# EAGLE design StandaloneAnemometer_RevB (EAGLE 7.6.0)

## Sheet 1 of 3
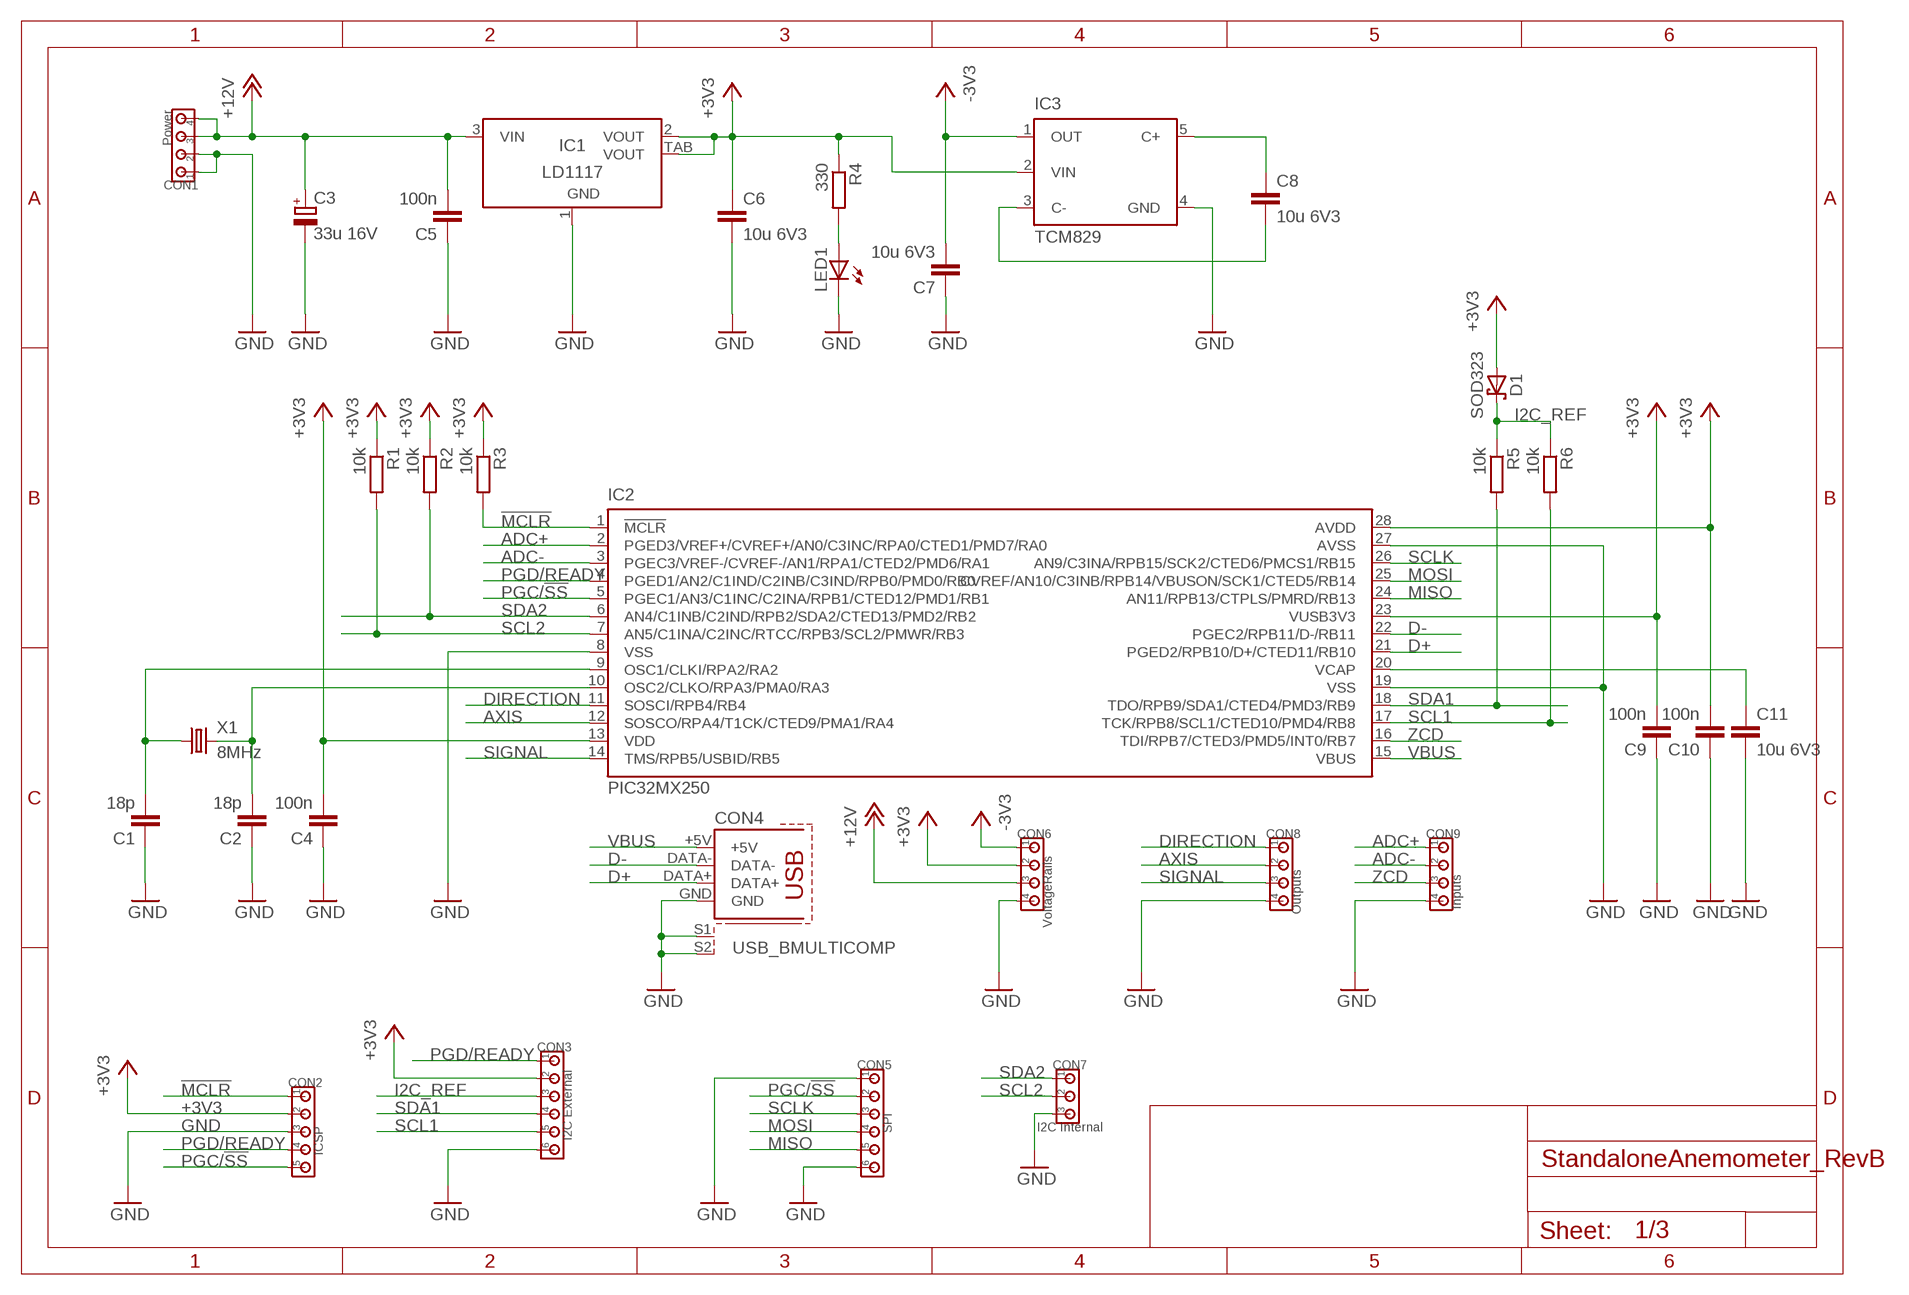
[diagram p0: schematic, sheet 1]

### Parts
C1  18p  CC0805  [C0805]
C2  18p  CC0805  [C0805]
C3  33u 16V  C_POLARIZEDSMC_B  [SMC_B]
C4  100n  CC0805  [C0805]
C5  100n  CC0805  [C0805]
C6  10u 6V3  CC0805  [C0805]
C7  10u 6V3  CC0805  [C0805]
C8  10u 6V3  CC0805  [C0805]
C9  100n  CC0805  [C0805]
C10  100n  CC0805  [C0805]
C11  10u 6V3  CC0805  [C0805]
CON1  Power  CON_4X100MIL  [100MIL_4X]
CON2  ICSP  CON_5X100MIL  [100MIL_5X]
CON3  I2C External  CON_6X100MIL  [100MIL_6X]
CON4  USB_BMULTICOMP  [USB_B]
CON5  SPI  CON_6X100MIL  [100MIL_6X]
CON6  VoltageRails  CON_4X100MIL  [100MIL_4X]
CON7  I2C Internal  CON_3X100MIL  [100MIL_3X]
CON8  Outputs  CON_4X100MIL  [100MIL_4X]
CON9  Inputs  CON_4X100MIL  [100MIL_4X]
D1  SOD323  SCHOTTKYSOD323  [SOD323]
IC1  LD1117  [SOT223]
IC2  PIC32MX250  PIC32MX2XX  [SO28W]
IC3  TCM829  [SOT-23-5]
LED1  LED0805  [LED0805]
R1  10k  RESISTORR0805  [R0805]
R2  10k  RESISTORR0805  [R0805]
R3  10k  RESISTORR0805  [R0805]
R4  330  RESISTORR0805  [R0805]
R5  10k  RESISTORR0805  [R0805]
R6  10k  RESISTORR0805  [R0805]
X1  8MHz  CRYSTAL5X3.2MM  [5X3.2MM]

### Nets
!MCLR!: CON2.1 IC2.1(!MCLR!) R3.2
+3V3: C4.2 C6.1 C9.2 C10.2 CON2.2 CON3.2 CON6.2 D1.A IC1.2(VOUT) IC1.TAB(VOUT) IC2.13(VDD) IC2.23(VUSB3V3) IC2.28(AVDD) IC3.2(VIN) R1.1 R2.1 R3.1 R4.1 ; also sheet 2,3
+12V: C3.+ C5.2 CON1.3 CON1.4 CON6.3 IC1.3(VIN) ; also sheet 2
-3V3: C7.2 CON6.1 IC3.1(OUT) ; also sheet 2,3
ADC+: CON9.1 IC2.2(PGED3/VREF+/CVREF+/AN0/C3INC/RPA0/CTED1/PMD7/RA0) ; also sheet 3
ADC-: CON9.2 IC2.3(PGEC3/VREF-/CVREF-/AN1/RPA1/CTED2/PMD6/RA1) ; also sheet 3
AXIS: CON8.2 IC2.12(SOSCO/RPA4/T1CK/CTED9/PMA1/RA4) ; also sheet 2,3
D+: CON4.DATA+ IC2.21(PGED2/RPB10/D+/CTED11/RB10)
D-: CON4.DATA- IC2.22(PGEC2/RPB11/D-/RB11)
DIRECTION: CON8.1 IC2.11(SOSCI/RPB4/RB4) ; also sheet 2,3
GND: C1.1 C2.1 C3.- C4.1 C5.1 C6.2 C7.1 C9.1 C10.1 C11.2 CON1.1 CON1.2 CON2.3 CON3.6 CON4.GND CON4.S1 CON4.S2 CON5.1 CON5.6 CON6.4 CON7.3 CON8.4 CON9.4 IC1.1(GND) IC2.8(VSS) IC2.19(VSS) IC2.27(AVSS) IC3.4(GND) LED1.C ; also sheet 2,3
I2C_REF: CON3.3 D1.C R5.1 R6.1
MISO: CON5.5 IC2.24(AN11/RPB13/CTPLS/PMRD/RB13)
MOSI: CON5.4 IC2.25(CVREF/AN10/C3INB/RPB14/VBUSON/SCK1/CTED5/RB14)
N$1: LED1.A R4.2
N$3: C8.2 IC3.3(C-)
N$4: C8.1 IC3.5(C+)
N$5: C1.2 IC2.9(OSC1/CLKI/RPA2/RA2) X1.1
N$9: C2.2 IC2.10(OSC2/CLKO/RPA3/PMA0/RA3) X1.2
N$11: C11.1 IC2.20(VCAP)
PGC/!SS!: CON2.5 CON5.2 IC2.5(PGEC1/AN3/C1INC/C2INA/RPB1/CTED12/PMD1/RB1)
PGD/READY: CON2.4 CON3.1 IC2.4(PGED1/AN2/C1IND/C2INB/C3IND/RPB0/PMD0/RB0)
SCL1: CON3.5 IC2.17(TCK/RPB8/SCL1/CTED10/PMD4/RB8) R6.2
SCL2: CON7.2 IC2.7(AN5/C1INA/C2INC/RTCC/RPB3/SCL2/PMWR/RB3) R1.2 ; also sheet 3
SCLK: CON5.3 IC2.26(AN9/C3INA/RPB15/SCK2/CTED6/PMCS1/RB15)
SDA1: CON3.4 IC2.18(TDO/RPB9/SDA1/CTED4/PMD3/RB9) R5.2
SDA2: CON7.1 IC2.6(AN4/C1INB/C2IND/RPB2/SDA2/CTED13/PMD2/RB2) R2.2 ; also sheet 3
SIGNAL: CON8.3 IC2.14(TMS/RPB5/USBID/RB5) ; also sheet 2
VBUS: CON4.+5V IC2.15(VBUS)
ZCD: CON9.3 IC2.16(TDI/RPB7/CTED3/PMD5/INT0/RB7) ; also sheet 3

## Sheet 2 of 3
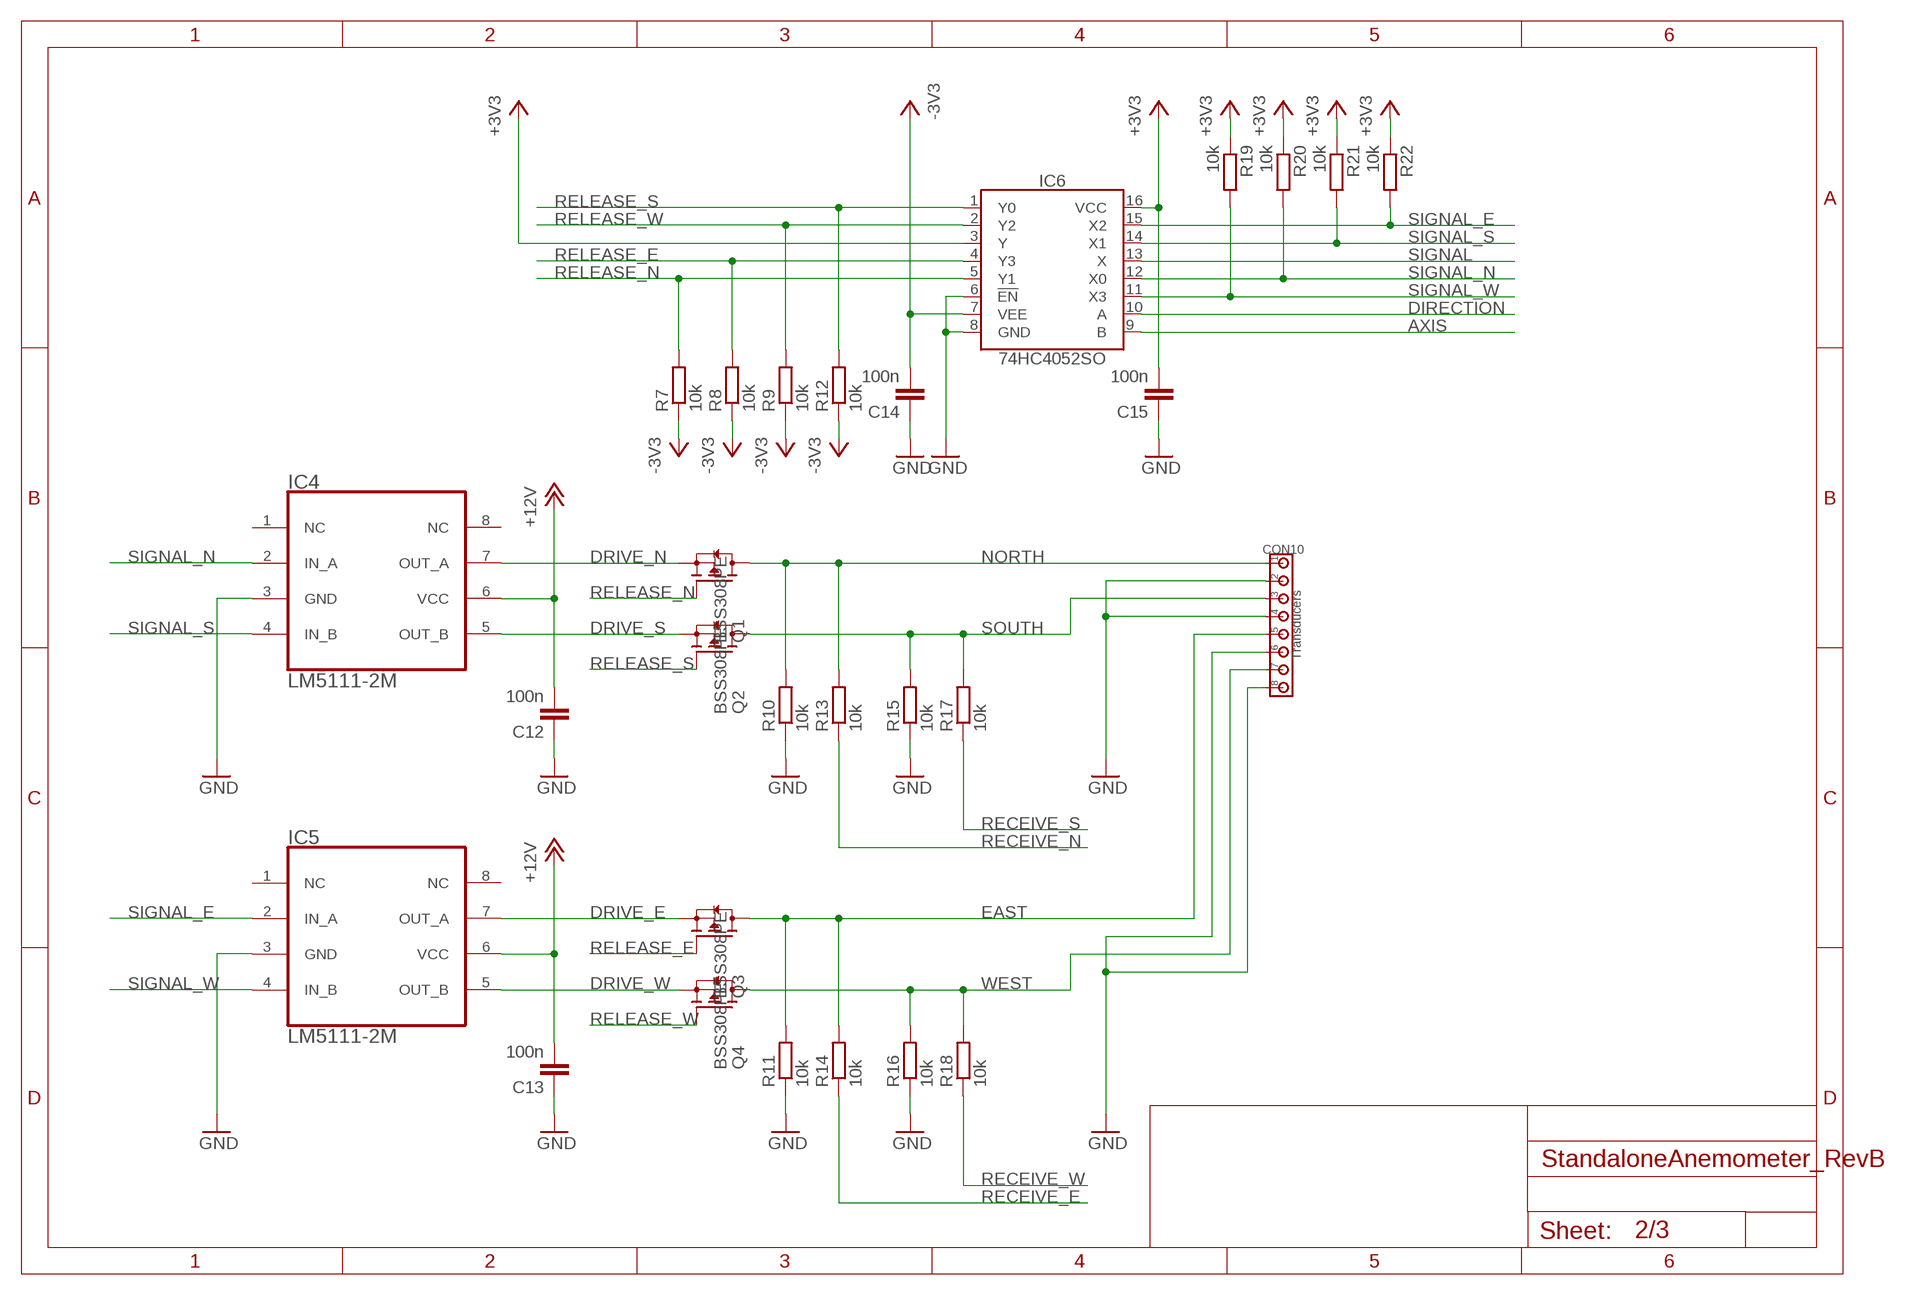
[diagram p1: schematic, sheet 2]

### Parts
C12  100n  CC0805  [C0805]
C13  100n  CC0805  [C0805]
C14  100n  CC0805  [C0805]
C15  100n  CC0805  [C0805]
CON10  Transducers  CON_8X  [100MIL_8X]
IC4  LM5111-2M  LM5111  [SOIC8]
IC5  LM5111-2M  LM5111  [SOIC8]
IC6  74HC4052SO  [SO16]
Q1  BSS308PE  P-FET  [SOT23]
Q2  BSS308PE  P-FET  [SOT23]
Q3  BSS308PE  P-FET  [SOT23]
Q4  BSS308PE  P-FET  [SOT23]
R7  10k  RESISTORR0805  [R0805]
R8  10k  RESISTORR0805  [R0805]
R9  10k  RESISTORR0805  [R0805]
R10  10k  RESISTORR0805  [R0805]
R11  10k  RESISTORR0805  [R0805]
R12  10k  RESISTORR0805  [R0805]
R13  10k  RESISTORR0805  [R0805]
R14  10k  RESISTORR0805  [R0805]
R15  10k  RESISTORR0805  [R0805]
R16  10k  RESISTORR0805  [R0805]
R17  10k  RESISTORR0805  [R0805]
R18  10k  RESISTORR0805  [R0805]
R19  10k  RESISTORR0805  [R0805]
R20  10k  RESISTORR0805  [R0805]
R21  10k  RESISTORR0805  [R0805]
R22  10k  RESISTORR0805  [R0805]

### Nets
+3V3: C15.2 IC6.3(Y) IC6.16(VCC) R19.1 R20.1 R21.1 R22.1 ; also sheet 1,3
+12V: C12.2 C13.2 IC4.6(VCC) IC5.6(VCC) ; also sheet 1
-3V3: C14.2 IC6.7(VEE) R7.1 R8.1 R9.1 R12.1 ; also sheet 1,3
AXIS: IC6.9(B) ; also sheet 1,3
DIRECTION: IC6.10(A) ; also sheet 1,3
DRIVE_E: IC5.7(OUT_A) Q3.2(S)
DRIVE_N: IC4.7(OUT_A) Q1.2(S)
DRIVE_S: IC4.5(OUT_B) Q2.2(S)
DRIVE_W: IC5.5(OUT_B) Q4.2(S)
EAST: CON10.5 Q3.3(D) R11.2 R14.2
GND: C12.1 C13.1 C14.1 C15.1 CON10.2 CON10.4 CON10.6 CON10.8 IC4.3(GND) IC5.3(GND) IC6.6(!EN!) IC6.8(GND) R10.1 R11.1 R15.1 R16.1 ; also sheet 1,3
NORTH: CON10.1 Q1.3(D) R10.2 R13.2
RECEIVE_E: R14.1 ; also sheet 3
RECEIVE_N: R13.1 ; also sheet 3
RECEIVE_S: R17.1 ; also sheet 3
RECEIVE_W: R18.1 ; also sheet 3
RELEASE_E: IC6.4(Y3) Q3.1(G) R8.2
RELEASE_N: IC6.5(Y1) Q1.1(G) R7.2
RELEASE_S: IC6.1(Y0) Q2.1(G) R12.2
RELEASE_W: IC6.2(Y2) Q4.1(G) R9.2
SIGNAL: IC6.13(X) ; also sheet 1
SIGNAL_E: IC5.2(IN_A) IC6.15(X2) R22.2
SIGNAL_N: IC4.2(IN_A) IC6.12(X0) R20.2
SIGNAL_S: IC4.4(IN_B) IC6.14(X1) R21.2
SIGNAL_W: IC5.4(IN_B) IC6.11(X3) R19.2
SOUTH: CON10.3 Q2.3(D) R15.2 R17.2
WEST: CON10.7 Q4.3(D) R16.2 R18.2
Unconnected: IC4.1(NC) IC4.8(NC) IC5.1(NC) IC5.8(NC)

## Sheet 3 of 3
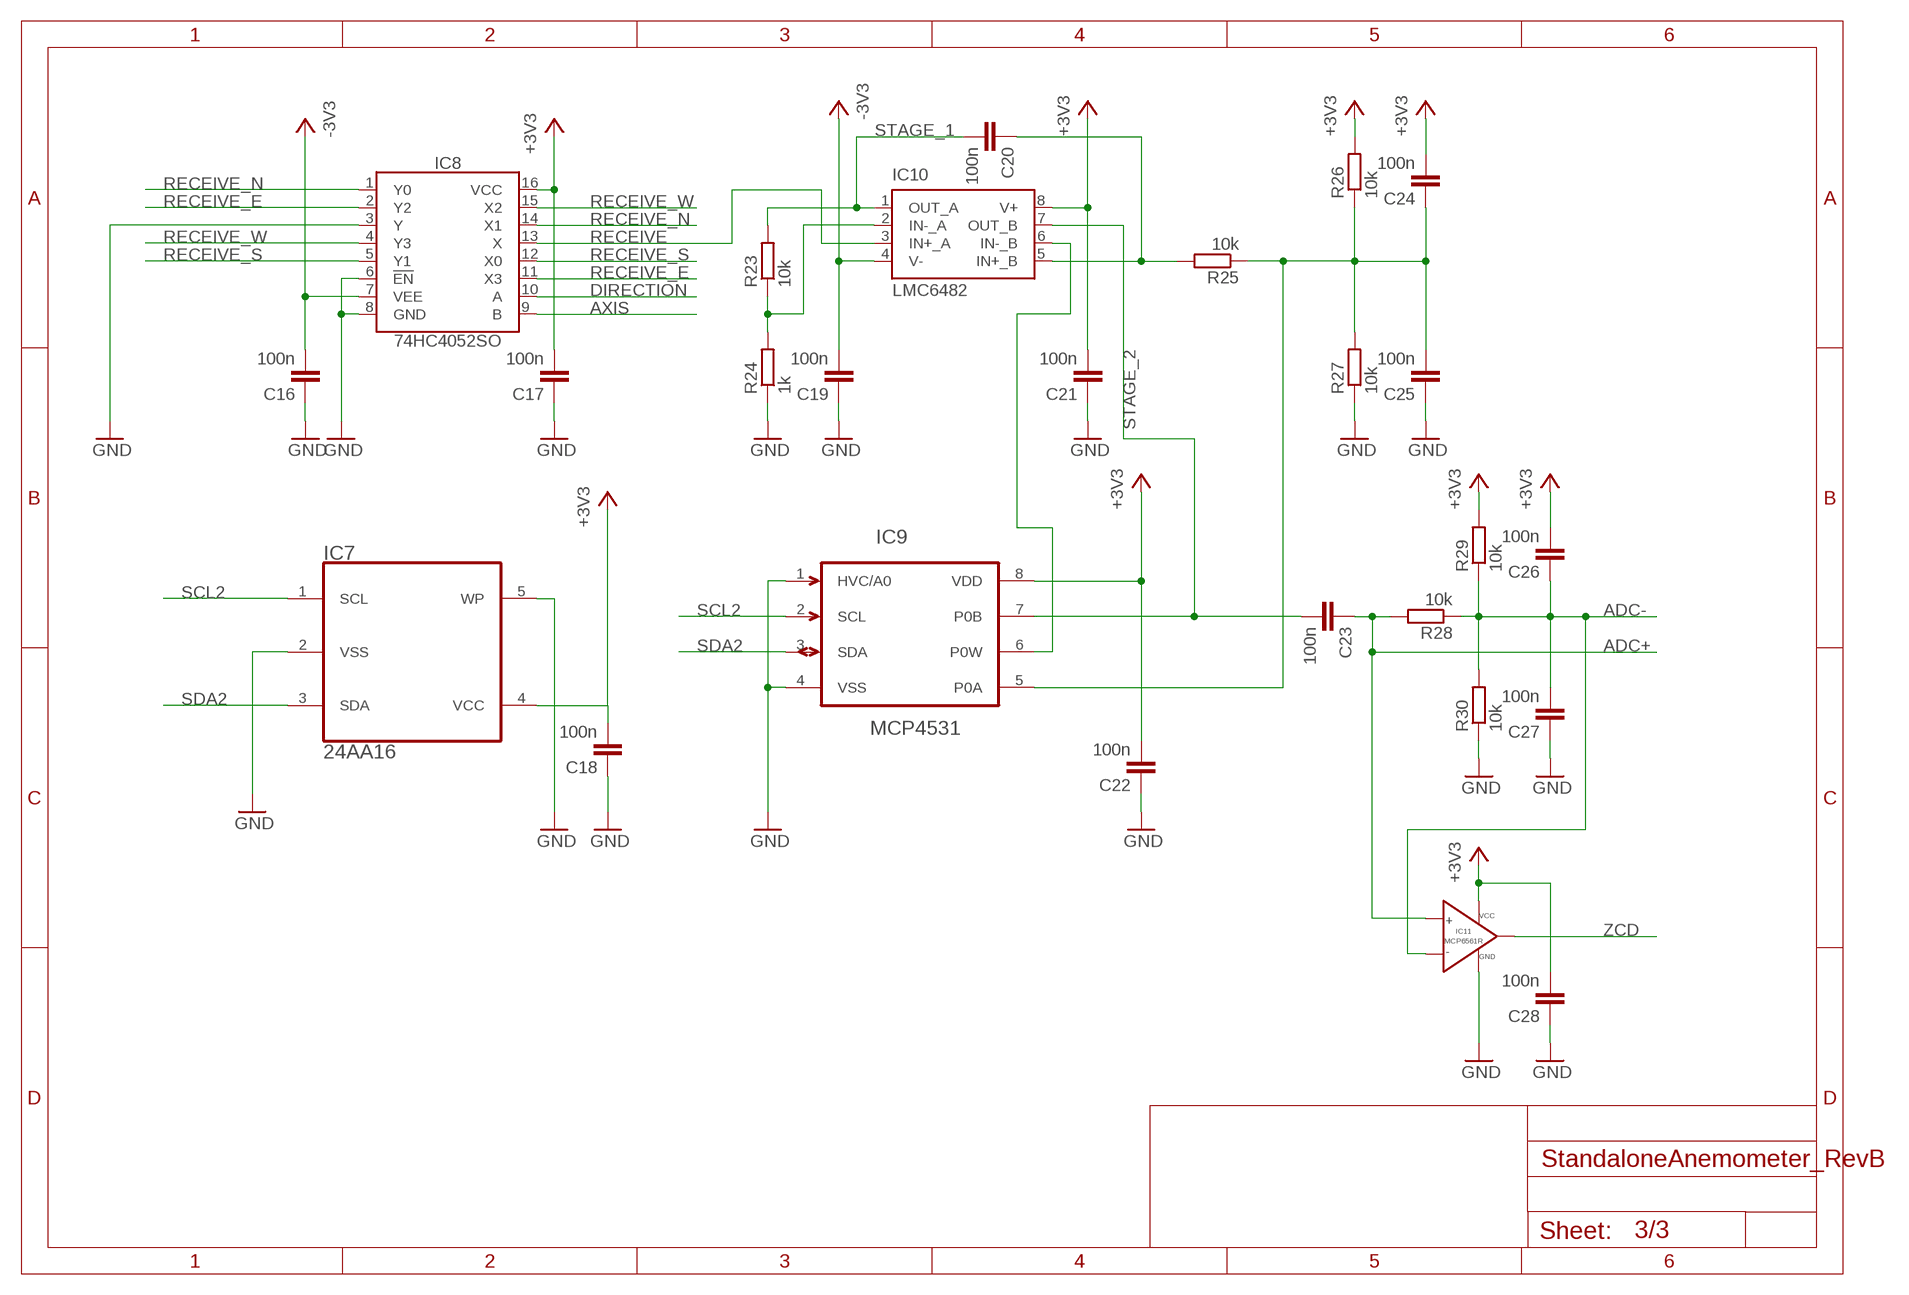
[diagram p2: schematic, sheet 3]

### Parts
C16  100n  CC0805  [C0805]
C17  100n  CC0805  [C0805]
C18  100n  CC0805  [C0805]
C19  100n  CC0805  [C0805]
C20  100n  CC0805  [C0805]
C21  100n  CC0805  [C0805]
C22  100n  CC0805  [C0805]
C23  100n  CC0805  [C0805]
C24  100n  CC0805  [C0805]
C25  100n  CC0805  [C0805]
C26  100n  CC0805  [C0805]
C27  100n  CC0805  [C0805]
C28  100n  CC0805  [C0805]
IC7  24AA16  [SOT-23-5]
IC8  74HC4052SO  [SO16]
IC9  MCP4531  [MSOP]
IC10  LMC6482  [SOIC8]
IC11  MCP6561R  [SOT-23-5]
R23  10k  RESISTORR0805  [R0805]
R24  1k  RESISTORR0805  [R0805]
R25  10k  RESISTORR0805  [R0805]
R26  10k  RESISTORR0805  [R0805]
R27  10k  RESISTORR0805  [R0805]
R28  10k  RESISTORR0805  [R0805]
R29  10k  RESISTORR0805  [R0805]
R30  10k  RESISTORR0805  [R0805]

### Nets
+3V3: C17.2 C18.2 C21.2 C22.2 C24.2 C26.2 C28.2 IC7.4(VCC) IC8.16(VCC) IC9.8(VDD) IC10.8(V+) IC11.2(VCC) R26.2 R29.2 ; also sheet 1,2
-3V3: C16.2 C19.2 IC8.7(VEE) IC10.4(V-) ; also sheet 1,2
ADC+: C23.1 IC11.3(VIN+) R28.2 ; also sheet 1
ADC-: C26.1 C27.2 IC11.4(VIN-) R28.1 R29.1 R30.2 ; also sheet 1
AXIS: IC8.9(B) ; also sheet 1,2
DIRECTION: IC8.10(A) ; also sheet 1,2
FB1: IC10.2(IN-_A) R23.1 R24.2
FB2: IC9.6(P0W) IC10.6(IN-_B)
GND: C16.1 C17.1 C18.1 C19.1 C21.1 C22.1 C25.1 C27.1 C28.1 IC7.2(VSS) IC7.5(WP) IC8.3(Y) IC8.6(!EN!) IC8.8(GND) IC9.1(HVC/A0) IC9.4(VSS) IC11.5(GND) R24.1 R27.1 R30.1 ; also sheet 1,2
N$27: C24.1 C25.2 IC9.5(P0A) R25.1 R26.1 R27.2
RECEIVE: IC8.13(X) IC10.3(IN+_A)
RECEIVE_E: IC8.2(Y2) IC8.11(X3) ; also sheet 2
RECEIVE_N: IC8.1(Y0) IC8.14(X1) ; also sheet 2
RECEIVE_S: IC8.5(Y1) IC8.12(X0) ; also sheet 2
RECEIVE_W: IC8.4(Y3) IC8.15(X2) ; also sheet 2
SCL2: IC7.1(SCL) IC9.2(SCL) ; also sheet 1
SDA2: IC7.3(SDA) IC9.3(SDA) ; also sheet 1
STAGE2_IN: C20.1 IC10.5(IN+_B) R25.2
STAGE_1: C20.2 IC10.1(OUT_A) R23.2
STAGE_2: C23.2 IC9.7(P0B) IC10.7(OUT_B)
ZCD: IC11.1(VOUT) ; also sheet 1

## Library data of the parts
C1 C2 C4-C28 = 00Capacitor:C: Capacitor
C3 = 00Capacitor:C_POLARIZED
CON1 CON6 CON8 CON9 = 00Connector:CON_4X: 4-pin header
CON2 = 00Connector:CON_5X: 5-pin header
CON3 CON5 = 00Connector:CON_6X: 6-pin header
CON4 = 00Connector:USB_B: Type B USB connector
CON7 = 00Connector:CON_3X: 3-pin header
CON10 = 00Connector:CON_8X: 8-pin header
D1 = 00Diode:SCHOTTKY
IC1 = 00VoltageRegulator:LD1117: Positive Voltage Regulator 800mA
IC2 = 00PIC:PIC32MX2XX
IC3 = 00VoltageRegulator:TCM829
IC4 IC5 = 00Logic:LM5111: Dual 5A Compound Gate Driver
IC6 IC8 = 00Logic:74HC4052
IC7 = 00Logic:24AA16: 16K I2C Serial EEPROM
IC9 = 00DigiPot:MCP4531: 7-Bit Singlel I2C Digital POT with Volatile Memory
IC10 = 00OpAmp:LMC6482: CMOS Dual Rail-to-Rail Input and Output Operational Amplifier
IC11 = 00OpAmp:MCP6561R: 1.8V Low-Power Push-Pull Output Comparator Propagation delay 80ns max
LED1 = 00Display:LED: LED
Q1-Q4 = 00Mosfet:P-FET
R1-R30 = 00Resistor:RESISTOR: RESISTOR, European symbol
X1 = 00Crystal:CRYSTAL: Crystal

## Board
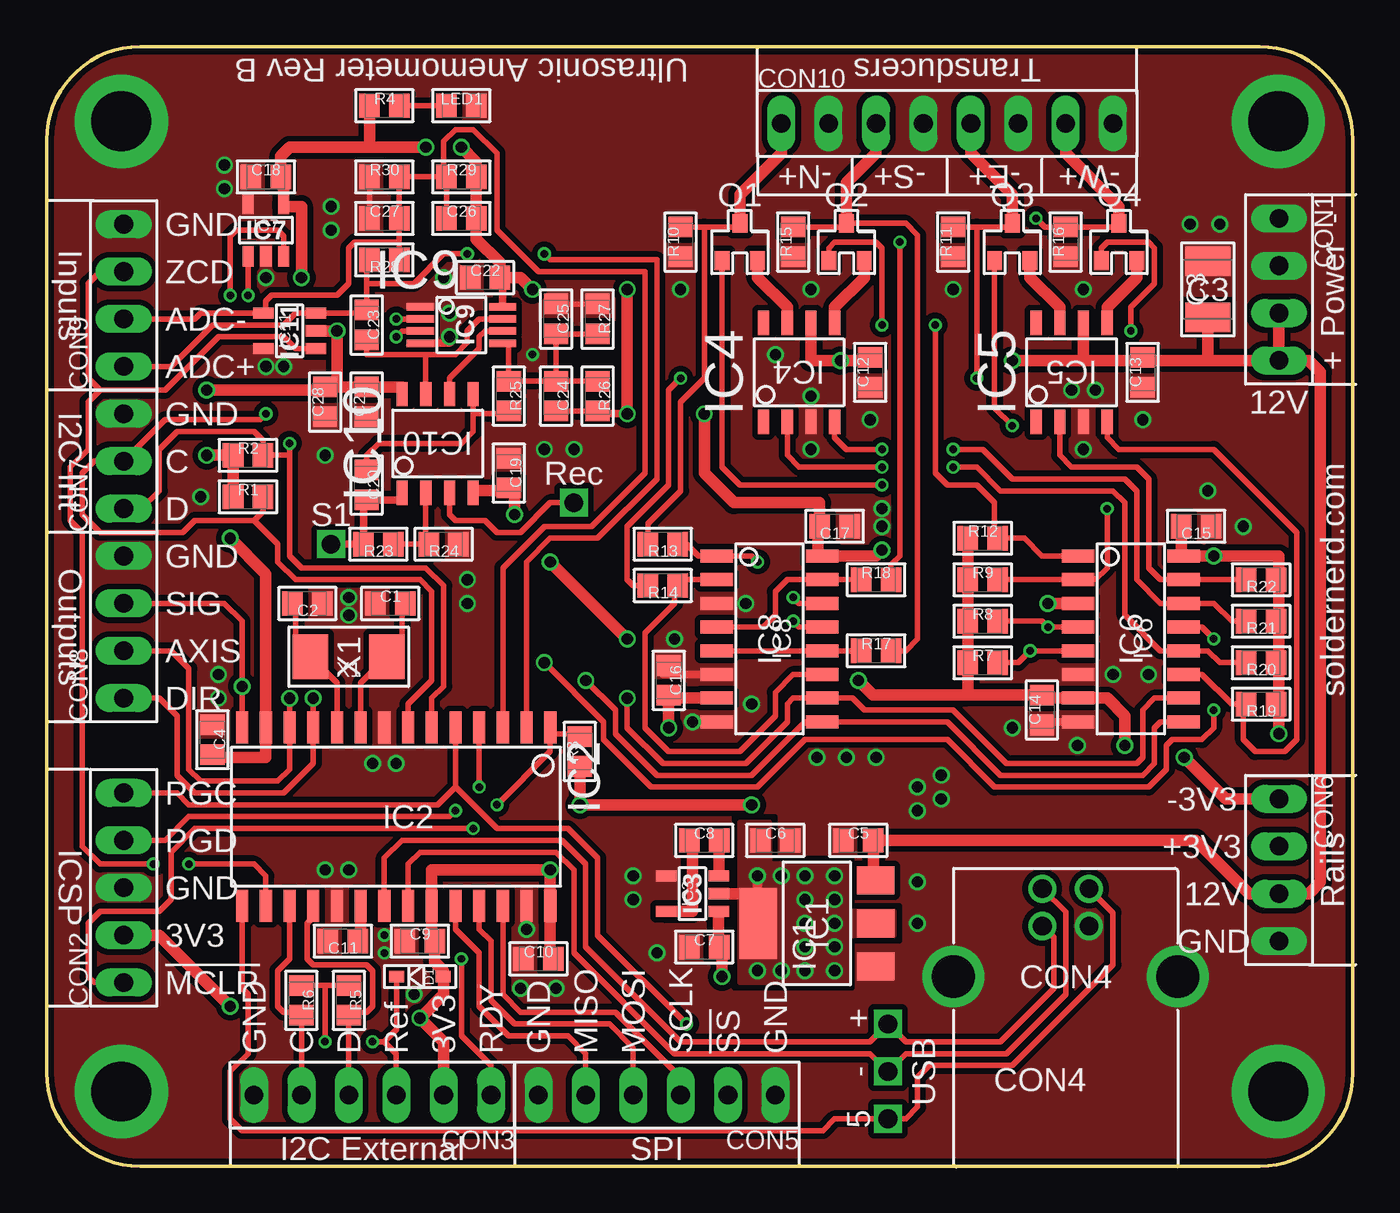
[diagram p3: board, top side]
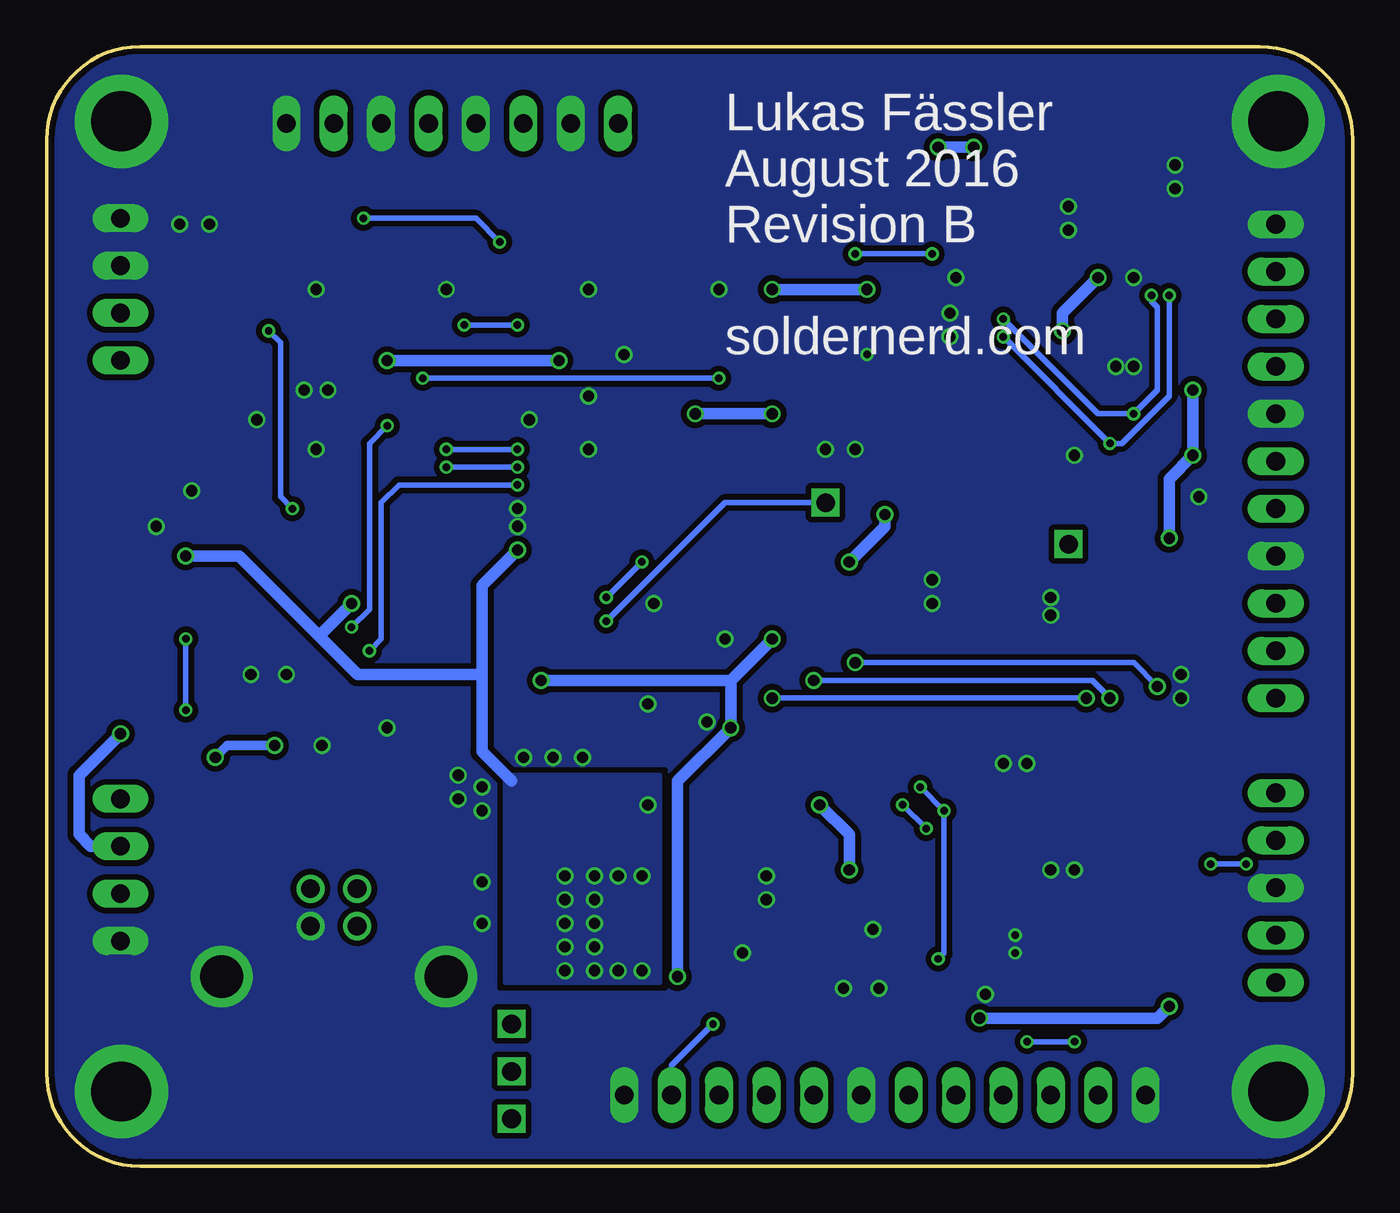
[diagram p4: board, bottom side, seen from below]

Size 70 x 60 mm. Coordinates in mm from the lower left corner, seen from the top.
Outline: 65,0 arc90 70,5
Outline: 70,55 arc90 65,60
Outline: 0,5 arc90 5,0
Outline: 65,60 5,60 arc90 0,55 0,5
Outline: 65,60 arc-90 70,55
Outline: 70,55 70,5
Outline: 70,5 arc-90 65,0
Outline: 65,0 5,0
Outline: 5,0 arc-90 0,5
Copper layers (1*16): Top 0.035mm / dielectric 1.5mm / Bottom 0.035mm
Design rules "dirt_cheap_dirty_boards.v1 *": minimum track width 5mil, minimum drill 12mil, track to track 5mil, track to pad 5mil, pad to pad 5mil, via to via 5mil, smd to smd 0mil, copper to edge 10mil, drill to drill 10mil, minimum pad ring 10mil, minimum via ring 6mil, stop-mask expansion 2mil, vias tented up to drill 25mil, thermal gap 10mil

### Footprints (pad centres in the part's own frame; a part is rotated, then mirrored left to right if it is on the bottom)
C0805 = smd 1.1 x 1.3: 1 -0.8,0; 2 0.8,0
SMC_B = smd 1.6 x 2.4: + -1.5,0; - 1.5,0
100MIL_4X = drill 1 long: 1 -3.81,0; 2 -1.27,0; 3 1.27,0; 4 3.81,0
100MIL_5X = drill 1 long: 1 -5.08,0; 2 -2.54,0; 3 0,0; 4 2.54,0; 5 5.08,0
100MIL_6X = drill 1 long: 1 -6.35,0; 2 -3.81,0; 3 -1.27,0; 4 1.27,0; 5 3.81,0; 6 6.35,0
USB_B = drill 1: +5V 1.25,4.71; DATA+ -1.25,2.71; DATA- -1.25,4.71; GND 1.25,2.71 | drill 2.3 pad 2.9: S1 -6.02,0; S2 6.02,0
100MIL_3X = drill 1 long: 1 -2.54,0; 2 0,0; 3 2.54,0
100MIL_8X = drill 1 long: 1 -8.89,0; 2 -6.35,0; 3 -3.81,0; 4 -1.27,0; 5 1.27,0; 6 3.81,0; 7 6.35,0; 8 8.89,0
SOD323 = smd 0.8 x 0.6: A 1.25,0; C -1.25,0
SOT223 = smd 1.5 x 2: 1 -2.3,-3.15; 2 0,-3.15; 3 2.3,-3.15 | smd 3.8 x 2: TAB 0,3.15
SO28W = smd 0.65 x 1.7: 1 -7.62,-4.78; 2 -6.35,-4.78; 3 -5.08,-4.78; 4 -3.81,-4.78; 5 -2.54,-4.78; 6 -1.27,-4.78; 7 0,-4.78; 8 1.27,-4.78; 9 2.54,-4.78; 10 3.81,-4.78; 11 5.08,-4.78; 12 6.35,-4.78; 13 7.62,-4.78; 14 8.89,-4.78; 15 8.89,4.78; 16 7.62,4.78; 17 6.35,4.78; 18 5.08,4.78; 19 3.81,4.78; 20 2.54,4.78; 21 1.27,4.78; 22 0,4.78; 23 -1.27,4.78; 24 -2.54,4.78; 25 -3.81,4.78; 26 -5.08,4.78; 27 -6.35,4.78; 28 -7.62,4.78
SOT-23-5 = smd 0.6 x 1.1: 1 -0.95,-1.4; 2 0,-1.4; 3 0.95,-1.4; 4 0.95,1.4; 5 -0.95,1.4
SOIC8 = smd 1.3 x 0.6: 1 -2.65,1.905; 2 -2.65,0.635; 3 -2.65,-0.635; 4 -2.65,-1.905; 5 2.65,-1.905; 6 2.65,-0.635; 7 2.65,0.635; 8 2.65,1.905
SO16 = smd 0.7 x 1.75: 1 -4.445,-2.825; 2 -3.175,-2.825; 3 -1.905,-2.825; 4 -0.635,-2.825; 5 0.635,-2.825; 6 1.905,-2.825; 7 3.175,-2.825; 8 4.445,-2.825; 9 4.445,2.825; 10 3.175,2.825; 11 1.905,2.825; 12 0.635,2.825; 13 -0.635,2.825; 14 -1.905,2.825; 15 -3.175,2.825; 16 -4.445,2.825
MSOP = smd 1.45 x 0.4: 1 -2.2,0.975; 2 -2.2,0.325; 3 -2.2,-0.325; 4 -2.2,-0.975; 5 2.2,-0.975; 6 2.2,-0.325; 7 2.2,0.325; 8 2.2,0.975
LED0805 = smd 1.1 x 1.3: A -0.8,0; C 0.8,0
SOT23 = smd 0.8 x 1: 1 -0.95,-1; 2 0.95,-1; 3 0,1
R0805 = smd 1.1 x 1.3: 1 -0.8,0; 2 0.8,0
5X3.2MM = smd 1.9 x 2.4: 1 -2.05,0; 2 2.05,0

### Placement (x,y rotation side)
C1  18.41,30.16 0 top
C2  13.97,30.16 180 top
C3  62.23,46.99 90 top
C4  8.89,22.86 270 top
C5  43.5,17.46 0 top
C6  39.05,17.46 0 top
C7  35.24,11.75 0 top
C8  35.24,17.46 0 top
C9  20,12.06 0 top
C10  26.35,11.11 0 top
C11  15.88,12.06 180 top
C12  44.13,42.55 90 top
C13  58.74,42.55 90 top
C14  53.34,24.45 90 top
C15  61.59,34.29 180 top
C16  33.34,26.04 270 top
C17  42.23,34.29 180 top
C18  11.75,53.02 0 top
C19  24.77,37.15 270 top
C20  17.14,36.51 270 top
C21  17.14,40.96 90 top
C22  23.5,47.62 0 top
C23  17.14,45.09 270 top
C24  27.3,41.27 270 top
C25  27.3,45.4 270 top
C26  22.23,50.8 0 top
C27  18.1,50.8 0 top
C28  14.92,40.96 90 top
CON1  66.04,46.99 270 top
CON2  4.13,14.92 90 top
CON3  17.46,3.81 180 top
CON4  54.61,10.16 0 top
CON5  32.7,3.81 180 top
CON6  66.04,15.88 270 top
CON7  4.13,37.78 90 top
CON8  4.13,28.89 90 top
CON9  4.13,46.67 90 top
CON10  48.26,55.88 0 top
D1  20,10.16 0 top
IC1  41.27,13.02 90 top
IC2  19.37,18.73 180 top
IC3  34.61,14.61 90 top
IC4  40.32,42.55 90 top
IC5  54.93,42.55 90 top
IC6  58.1,28.26 270 top
IC7  11.75,50.16 0 top
IC8  38.73,28.26 270 top
IC9  22.23,45.09 0 top
IC10  20.95,38.73 90 top
IC11  13.02,44.77 90 top
LED1  22.23,56.83 0 top
Q1  37.15,49.53 0 top
Q2  42.86,49.53 0 top
Q3  51.75,49.53 0 top
Q4  57.47,49.53 0 top
R1  10.79,35.88 0 top
R2  10.79,38.1 0 top
R3  28.57,22.23 90 top
R4  18.1,56.83 0 top
R5  16.19,8.89 270 top
R6  13.65,8.89 270 top
R7  50.16,26.99 0 top
R8  50.16,29.21 0 top
R9  50.16,31.43 0 top
R10  33.97,49.53 90 top
R11  48.58,49.53 90 top
R12  50.16,33.66 0 top
R13  33.02,33.34 180 top
R14  33.02,31.11 180 top
R15  40.01,49.53 90 top
R16  54.61,49.53 90 top
R17  44.45,27.62 0 top
R18  44.45,31.43 0 top
R19  65.09,24.77 180 top
R20  65.09,26.99 180 top
R21  65.09,29.21 180 top
R22  65.09,31.43 180 top
R23  17.78,33.34 180 top
R24  21.27,33.34 180 top
R25  24.77,41.27 270 top
R26  29.53,41.27 270 top
R27  29.53,45.4 270 top
R28  18.1,48.58 180 top
R29  22.23,53.02 0 top
R30  18.1,53.02 0 top
X1  16.19,27.3 180 top

### Tracks (layer width: path | path; a pad name or v marks a point on that pad's centre or on a via)
!MCLR!  (via drill 0.4)
  Top 0.305: R3.2 28.43,23.18 26.99,23.18 26.99,22.23 v24.13,19.37 | v22.86,18.1 7.94,18.1 6.67,16.83 6.67,14.29 6.03,13.65 2.86,13.65 2.22,13.02 2.22,10.16 2.54,9.84 CON2.1
  Top 0.406: IC2.1 26.99,23.18
  Bottom 0.305: v24.13,19.37 v22.86,18.1
+3V3  (via drill 0.6)
  Top 0.305: C24.2 R26.2 | 8.89,21.91 C4.2 | 14.92,41.91 15.55,41.91 15.56,41.91 | 26.99,11.43 27.15,11.43 C10.2
  Top 0.406: IC6.16 60.65,32.7 60.64,32.7 | C17.2 41.34,34.29 | v31.11,40.32 29.53,40.32 R26.2 | IC9.8 24.43,47.62 C22.2 | 12.7,52.87 C18.2
  Top 0.508: 38.1,14.61 v38.1,15.56
  Top 0.61: v35.24,40.32 35.24,37.15 36.83,35.56 41.43,35.56 C17.2 | v44.77,33.02 44.45,32.7 IC8.16 41.34,32.93 41.34,34.29 | 8.89,21.91 11.75,21.91 IC2.13 11.75,31.75 v9.84,33.66 | 26.99,11.43 IC2.28 v26.99,15.88 20.64,15.88 IC2.23 20.64,12.23 C9.2 20.8,10.95 21.25,10.5 D1.A 21.27,10.14 21.27,9.21 v20,7.94 21.27,6.67 CON3.2 | IC11.2 v15.56,44.77 15.56,41.91 | v8.57,38.1 R2.1 R1.1 | CON2.2 6.03,12.38 v9.84,8.57 | IC6.3 v53.66,30.16 | R3.1 v28.57,19.37 v37.78,19.37 | v31.11,46.99 v31.11,40.32 | C28.2 14.92,41.59 v8.57,41.59 | C28.2 14.92,41.91 | IC3.2 38.1,14.61 | 66.04,24.77 v66.04,23.18 | R19.1 66.04,24.77 | 66.04,24.77 66.04,26.84 R20.1 66.04,27.14 66.04,29.21 R21.1 arc90 66.04,29.36 66.04,31.43 R22.1 arc90 66.04,31.59 66.04,32.7 v62.55,32.7 IC6.16 60.8,32.84 C15.2 | v26.04,46.99 25.4,47.62 C22.2 24.3,48.41 23.02,49.68 C26.2 R29.2 23.02,53.81 v22.23,54.61 | IC10.8 19.05,41.76 C21.2 C28.2 | v13.65,47.62 13.65,51.44 12.7,51.44 IC7.4 12.7,52.87 | C18.2 12.55,54.14 13.02,54.61 17.14,54.61 | 17.14,54.61 v20.32,54.61 | R4.1 17.3,54.76 17.14,54.61
  Bottom 0.61: v44.77,33.02 46.67,31.11 46.67,26.35 | v31.11,40.32 v35.24,40.32 | v31.11,46.99 v26.04,46.99 | v9.84,8.57 10.48,7.94 v20,7.94 | 46.67,26.35 46.67,22.23 45.09,20.64 | 46.67,26.35 53.34,26.35 55.24,28.26 | v9.84,33.66 9.84,36.83 v8.57,38.1 v8.57,41.59 | v22.23,54.61 v20.32,54.61 | CON6.2 67.63,17.14 68.26,17.78 68.26,20.95 v66.04,23.18 | v28.57,19.37 26.99,17.78 v26.99,15.88 | v13.65,47.62 15.56,45.72 v15.56,44.77 | 55.24,28.26 59.69,32.7 v62.55,32.7 | v53.66,30.16 55.24,28.57 55.24,28.26
  other vias: 39.37,15.56 40.64,15.56 42.23,15.56 42.23,14.29 40.64,14.29 40.64,13.02 42.23,13.02 42.23,11.75 40.64,11.75 40.64,10.48 42.23,10.48 39.37,10.48 38.1,10.48
  pour Top (isolate 0.305, no thermals): 45.4,13.65 42.86,13.65 42.86,16.19 38.73,16.19 38.73,18.41 37.15,18.41 37.15,9.84 42.86,9.84 42.86,12.38 45.4,12.38
  pour Bottom (isolate 0.305, no thermals): 37.15,9.84 37.15,20.95 45.4,20.95 45.4,9.84
+12V  (via drill 0.6)
  Top 0.61: IC4.6 40.96,43.18 v42.55,43.18 44.13,43.18 C12.2 | CON1.3 CON1.4 | CON1.4 62.23,43.18 | 62.23,43.18 58.74,43.18 | C3.+ 62.23,43.18 | CON1.4 67.63,43.18 68.26,42.55 68.26,15.24 67.63,14.61 CON6.3 64.45,14.61 61.59,17.46 C5.2 44.3,15.45 IC1.3 | v51.75,43.18 55.56,43.18 | 55.56,43.18 IC5.6 | 55.56,43.18 58.74,43.18 | 58.74,43.18 C13.2
  Bottom 0.61: v51.75,43.18 v42.55,43.18
-3V3  (via drill 0.6)
  Top 0.305: IC10.4 22.86,36.2
  Top 0.406: C19.2 arc-90 25.08,35.88
  Top 0.508: 35.88,13.65 IC3.1
  Top 0.61: IC8.7 33.34,25.08 | 33.34,25.08 33.02,25.08 | 33.34,25.08 v33.34,23.5 | R12.1 R9.1 R8.1 R7.1 49.37,25.4 49.21,25.25 | 25.08,35.88 v25.08,34.92 | v57.78,22.54 57.78,24.13 56.83,25.08 IC6.7 53.34,25.08 C14.2 49.21,25.25 | CON6.1 63.18,19.68 v60.96,21.91 | 49.21,25.25 44.28,25.25 v43.5,26.04 | v36.2,10.16 36.2,11.6 C7.2 36.01,11.78 IC3.1 | v31.11,28.26 v26.99,32.38 | 22.86,36.2 24.61,36.2 C19.2 | C16.2 33.34,25.08
  Bottom 0.508: v57.78,22.54 60.33,22.54 v60.96,21.91
  Bottom 0.61: v43.5,26.04 33.34,26.04 | 33.34,26.04 v33.34,23.5 36.2,20.64 v36.2,10.16 | v26.99,32.38 25.08,34.29 v25.08,34.92 | 33.34,26.04 v31.11,28.26
ADC+  (via drill 0.4)
  Top 0.305: IC2.2 25.72,32.38 26.99,33.66 29.53,33.66 32.7,36.83 32.7,48.58 26.99,48.58 v26.67,48.9 | CON9.1 6.67,42.86 8.89,45.09 12.7,45.09 13.33,45.72 IC11.3 16.51,45.72 17.14,45.72 C23.1 17.14,47.31 | 17.14,47.31 17.14,48.42 R28.2 | v22.54,48.9 21.27,48.9 19.68,47.31 17.14,47.31
  Bottom 0.305: v26.67,48.9 v22.54,48.9
ADC-
  Top 0.305: R29.1 C26.1 21.27,50.8 | R29.1 R30.2 C27.2 18.9,49.53 | 18.9,49.53 R28.1 | IC2.3 24.45,32.07 26.67,34.29 29.21,34.29 32.07,37.15 32.07,47.94 26.35,47.94 24.13,50.16 24.13,54.29 22.86,55.56 21.91,55.56 21.27,54.93 21.27,53.17 R29.1 | 21.27,53.02 R29.1 | CON9.2 7.94,45.4 8.25,45.72 IC11.4 11.75,45.72 11.75,46.35 12.06,46.67 15.56,46.67 16.19,47.31 16.19,49.21 16.51,49.53 18.9,49.53
AXIS  (via drill 0.6)
  Top 0.305: IC6.9 59.69,23.81 59.37,23.5 59.37,21.59 58.74,20.95 51.12,20.95 48.26,23.81 IC8.9 40.64,23.81 37.78,20.95 32.7,20.95 30.48,23.18 30.48,24.45 v28.89,26.04 | v13.02,25.08 IC2.12 13.02,21.27 12.38,20.64 8.26,20.64 7.62,21.27 7.62,26.67 6.67,27.62 CON8.2
  Bottom 0.305: v28.89,26.04 13.97,26.04 v13.02,25.08
D+  (via drill 1)
  Top 0.305: IC2.21 18.1,16.51 19.05,17.46 27.62,17.46 28.89,16.19 28.89,11.75 33.97,6.67 44.13,6.67 v45.09,7.62 46.04,6.67 51.12,6.67 53.98,9.53 53.98,12.26 CON4.DATA+
D-  (via drill 1)
  Top 0.305: IC2.22 19.37,16.19 20,16.83 27.3,16.83 28.26,15.88 28.26,11.43 33.66,6.03 44.13,6.03 v45.09,5.08 46.04,6.03 51.44,6.03 54.61,9.21 54.61,13.62 CON4.DATA-
DIRECTION  (via drill 0.6)
  Top 0.305: IC6.10 59.37,25.08 58.74,24.45 58.74,21.91 58.42,21.59 51.44,21.59 48.58,24.45 43.81,24.45 43.18,25.08 IC8.10 40.01,25.08 39.69,24.77 39.69,23.81 37.47,21.59 33.02,21.59 31.11,23.5 v31.11,25.08 | v14.29,25.08 IC2.11 14.29,21.59 12.7,20 7.94,20 6.99,20.95 6.99,24.13 6.03,25.08 CON8.1
  Bottom 0.305: v31.11,25.08 v14.29,25.08
DRIVE_E
  Top 0.61: IC5.7 54.29,46.04 52.7,47.62 Q3.2
DRIVE_N
  Top 0.61: IC4.7 39.69,46.04 38.1,47.62 Q1.2
DRIVE_S
  Top 0.61: IC4.5 42.23,46.04 43.81,47.62 Q2.2
DRIVE_W
  Top 0.61: IC5.5 56.83,46.04 58.42,47.62 Q4.2
EAST  (via drill 0.4)
  Top 0.305: 49.85,50.33 v49.85,42.23 | v33.97,42.23 33.34,41.59 33.34,36.51 31.11,34.29 31.11,31.43 31.43,31.11 R14.2 | R11.2 49.85,50.33 | 49.85,50.33 51.75,50.33 Q3.3
  Top 0.61: CON10.5 49.53,54.29 51.75,52.07 Q3.3
  Bottom 0.305: v49.85,42.23 v33.97,42.23
FB1
  Top 0.305: R23.1 R24.2 20.32,33.34 IC10.2
FB2
  Top 0.305: IC10.6 21.59,42.23 23.18,43.81 23.18,44.45 23.49,44.76 IC9.6
GND  (via drill 0.4, 0.6, 3.2 pad 5)
  Top 0.305: R27.1 C25.1 | R30.1 C27.1
  Top 0.406: IC6.8 53.34,23.81 C14.1 | IC8.6 33.02,26.35 | IC8.8 36.2,23.81 | IC9.4 21.59,44.11 v21.59,44.45
  other vias: 4,56 66,56 66,4 4,4 64.14,34.29 44.13,40.01 58.74,40.01 44.77,34.29 33.66,28.26 15.24,50.16 21.27,47.62 9.53,52.39 11.75,42.86 14.92,38.1 8.26,35.88 11.75,47.62 28.26,38.42 12.7,42.86 26.04,43.5 16.19,30.48 9.21,25.08 26.67,38.42 22.54,30.16 18.1,12.38 47.94,20.95 18.1,11.43 51.75,23.5 37.78,24.77 31.43,15.56 31.43,14.29 32.7,11.43 47.94,19.68 46.67,19.05 46.67,20.32 25.72,12.7 25.4,9.53 27.3,9.53 34.61,23.81 14.92,15.88 16.19,15.88 17.46,21.59 18.73,21.59 21.59,45.72 16.19,29.53 9.53,53.66 40.96,38.42 54.93,41.59 39.05,43.5 56.2,41.59 9.21,26.35 22.54,31.43 15.24,51.44 40.96,46.99 55.56,46.99 61.28,50.48 62.87,50.48 33.97,46.99 48.58,46.99 55.56,38.42 40.96,41.27 57.15,26.35 59.05,26.35 55.24,22.54 62.23,36.2 44.77,35.24 37.47,30.16 41.27,21.91 42.86,21.91 44.45,21.91 46.67,15.24 46.67,13.02 19.68,9.21
  pour Top (isolate 0.305, rank 2, no thermals): 65,60 5,60 arc90 0,55 0,5 arc90 5,0 65,0 arc90 70,5 70,55 arc90
  pour Bottom (isolate 0.305, rank 3, no thermals): 0,5 0,55 arc-90 5,60 65,60 arc-90 70,55 70,5 arc-90 65,0 5,0 arc-90
I2C_REF  (via drill 0.4)
  Top 0.305: R6.1 14.92,9.69 | 14.92,9.69 R5.1 | CON3.3 18.73,6.03 18.1,6.67 | 18.1,6.67 v17.46,6.67 | v14.92,6.67 14.92,9.69 | D1.C 18.75,7.32 18.1,6.67
  Bottom 0.305: v17.46,6.67 v14.92,6.67
MISO
  Top 0.305: CON5.5 28.89,6.03 27.94,6.99 24.77,6.99 23.18,8.57 23.18,11.43 21.91,12.7 IC2.24
MOSI
  Top 0.305: CON5.4 31.43,6.35 30.16,7.62 25.08,7.62 23.81,8.89 23.81,12.06 23.18,12.7 IC2.25
N$1
  Top 0.305: R4.2 LED1.A
N$3
  Top 0.508: C8.2 35.91,17.46
  Top 0.61: IC3.3 36.04,15.59 C8.2
N$4
  Top 0.508: 34.61,17.46 C8.1
  Top 0.61: IC3.5 34.61,13.65 34.61,17.46
N$5
  Top 0.305: IC2.9 16.83,25.89 X1.1 19.05,27.3 19.05,30.16 C1.2
N$9
  Top 0.305: C2.2 13.34,30.16 13.34,27.3 X1.2 15.56,25.89 IC2.10
N$11
  Top 0.61: IC2.20 16.83,12.22 C11.1
N$27
  Top 0.305: R26.1 C24.1 | C24.1 C25.2 R27.2 | C24.1 R25.1 24.77,44.11 IC9.5
NORTH
  Top 0.305: 35.24,50.33 35.24,42.23 33.97,40.96 33.97,36.2 32.22,34.44 R13.2 | R10.2 35.24,50.33 | 35.24,50.33 37.15,50.33 Q1.3
  Top 0.61: CON10.1 39.37,54.29 37.15,52.07 Q1.3
PGC/!SS!  (via drill 0.4)
  Top 0.305: IC2.5 21.91,20.32 | 21.91,20.32 24.13,18.1 27.94,18.1 29.53,16.51 29.53,12.38 v34.29,7.62 | CON2.5 6.99,20 7.62,19.37 20.95,19.37 21.91,20.32
  Bottom 0.305: v34.29,7.62 36.51,5.4 CON5.2
PGD/READY  (via drill 0.4)
  Top 0.305: IC2.4 v23.18,20.32 | CON2.4 6.35,17.46 7.62,18.73 21.59,18.73 v21.91,19.05 | CON3.1 23.81,5.4 22.23,6.99 v22.23,11.11
  Bottom 0.305: v22.23,11.11 21.91,11.43 v21.91,19.05 v23.18,20.32
RECEIVE  (via drill 0.4, 1)
  Top 0.305: IC8.13 40.32,28.89 v40.01,29.21 | v28.26,35.56 26.99,35.56 25.4,33.97 24.13,33.97 23.5,34.61 21.91,34.61 21.59,34.92 IC10.3
  Bottom 0.305: v28.26,35.56 33.66,35.56 v40.01,29.21
RECEIVE_E
  Top 0.305: IC8.2 33.66,31.43 33.66,31.28 | IC8.11 40.01,26.35 39.05,25.4 39.05,24.13 37.15,22.23 33.34,22.23 32.07,23.5 32.07,28.57 33.66,30.16 33.66,31.28 | 33.66,31.28 R14.1
RECEIVE_N  (via drill 0.4)
  Top 0.305: IC8.14 40.32,30.16 v40.01,30.48 | v38.1,32.38 37.78,32.7 IC8.1 34.92,32.7 34.29,33.34 R13.1
  Bottom 0.305: v38.1,32.38 v40.01,30.48
RECEIVE_S
  Top 0.305: IC8.5 IC8.12 R17.1
RECEIVE_W
  Top 0.305: R18.1 IC8.15 39.69,31.43 39.05,30.8 39.05,29.53 38.42,28.89 IC8.4
RELEASE_E  (via drill 0.4)
  Top 0.305: IC6.4 v53.66,28.89 53.34,29.21 R8.2 | Q3.1 50.8,40.64 v51.75,39.69
  Bottom 0.305: v51.75,39.69 52.7,38.73 52.7,29.84 v53.66,28.89
RELEASE_N  (via drill 0.4)
  Top 0.305: IC6.5 v52.7,27.62 52.07,26.99 R7.2 | Q1.1 36.2,37.47 37.15,36.51 v44.77,36.51
  Bottom 0.305: v44.77,36.51 51.12,36.51 52.07,35.56 52.07,28.26 v52.7,27.62
RELEASE_S  (via drill 0.4)
  Top 0.305: IC6.1 53.34,32.7 52.39,33.66 R12.2 50.8,33.66 50.8,35.56 49.85,36.51 48.26,36.51 47.62,37.15 v47.62,45.09 | v44.77,45.09 44.77,49.21 44.45,49.53 42.23,49.53 41.91,49.21 Q2.1
  Bottom 0.305: v44.77,45.09 v47.62,45.09
RELEASE_W  (via drill 0.4)
  Top 0.305: R9.2 IC6.2 56.2,31.43 56.83,32.07 v56.83,35.24 | v58.1,44.77 58.1,46.04 59.37,47.31 59.37,49.21 59.05,49.53 56.83,49.53 56.52,49.21 Q4.1
  Bottom 0.305: v58.1,44.77 57.47,44.13 57.47,35.88 v56.83,35.24
SCL1
  Top 0.305: CON3.5 R6.2 13.49,8.26 12.7,8.26 12.38,8.57 12.38,10.48 13.02,11.11 IC2.17
SCL2  (via drill 0.4)
  Top 0.305: IC2.7 19.37,24.77 20.64,26.04 20.64,30.8 20,31.43 13.34,31.43 12.38,32.38 12.38,33.34 11.11,34.61 | v10.79,46.67 10.79,48.87 10.8,48.86 IC7.1 | R1.2 11.6,35.09 11.11,34.61 | 11.11,34.61 7.94,34.61 7.3,33.97 2.86,33.97 1.91,34.92 1.91,37.15 2.54,37.78 CON7.2 6.35,40.01 11.43,40.01 v11.75,40.32 | IC9.2 20.02,45.4 v18.73,45.4
  Bottom 0.305: v10.79,46.67 10.79,46.35 10.48,46.04 10.48,41.59 v11.75,40.32 13.65,40.32 v18.73,45.4
SCLK
  Top 0.305: CON5.3 33.97,4.76 30.48,8.26 25.4,8.26 24.45,9.21 IC2.26
SDA1
  Top 0.305: CON3.4 R5.2 16.36,8.26 17.14,8.26 17.46,8.57 17.46,10.48 17.14,10.79 14.29,10.79 13.97,11.11 13.97,13.02 14.29,13.34 IC2.18
SDA2  (via drill 0.4)
  Top 0.305: IC2.6 20.64,25.08 21.27,25.72 21.27,31.11 20.32,32.07 13.65,32.07 13.02,32.7 13.02,38.1 | 13.02,38.1 v13.02,38.73 | 13.02,38.1 R2.2 11.6,38.89 11.11,39.37 6.99,39.37 6.03,38.42 6.03,36.2 5.08,35.24 CON7.1 | v18.73,44.45 19.04,44.76 IC9.3 | IC7.3 12.7,49.85 12.38,50.16 10.16,50.16 9.84,49.85 v9.84,46.67
  Bottom 0.305: v9.84,46.67 9.84,41.27 12.38,38.73 v13.02,38.73 v18.73,44.45
SIGNAL  (via drill 0.4, 0.6)
  Top 0.305: v62.55,28.26 61.91,28.89 IC6.13 | IC2.14 v10.48,25.72 10.48,29.21 9.53,30.16 CON8.3 | v26.67,26.99 29.84,23.81 29.84,22.86 32.38,20.32 38.1,20.32 40.64,22.86 48.26,22.86 50.8,20.32 59.05,20.32 60.01,21.27 60.01,22.54 60.33,22.86 61.91,22.86 62.55,23.5 v62.55,24.45
  Bottom 0.305: v62.55,28.26 v62.55,24.45 | v26.67,26.99 11.75,26.99 v10.48,25.72
SIGNAL_E
  Top 0.305: IC5.2 54.29,38.1 54.93,37.47 58.42,37.47 59.05,36.83 59.05,32.07 59.69,31.43 IC6.15 R22.2
SIGNAL_N  (via drill 0.4)
  Top 0.305: IC4.2 39.69,38.1 40.32,37.47 v44.77,37.47 | R20.2 62.87,26.99 62.23,27.62 IC6.12 59.69,27.62 57.78,29.53 57.78,35.56 57.15,36.2 51.12,36.2 49.85,37.47 v48.58,37.47
  Bottom 0.305: v44.77,37.47 v48.58,37.47
SIGNAL_S  (via drill 0.4)
  Top 0.305: IC4.4 42.23,39.05 42.86,38.42 v44.77,38.42 | v48.58,38.42 50.16,38.42 51.75,36.83 57.78,36.83 58.42,36.2 58.42,31.43 59.69,30.16 IC6.14 62.55,30.16 63.5,29.21 R21.2
  Bottom 0.305: v44.77,38.42 v48.58,38.42
SIGNAL_W
  Top 0.305: IC5.4 56.83,39.05 57.47,38.42 62.55,38.42 66.99,33.97 66.99,22.86 66.36,22.23 64.77,22.23 64.14,22.86 64.14,24.77 R19.2 63.5,24.77 61.91,26.35 IC6.11
SOUTH
  Top 0.305: R15.2 42.86,50.33 Q2.3 46.04,50.53 46.67,49.9 46.67,28.26 46.04,27.62 R17.2
  Top 0.61: CON10.3 44.45,54.29 42.86,52.7 Q2.3
STAGE2_IN
  Top 0.305: IC10.5 22.86,40.32 | 22.86,40.32 22.86,39.37 22.23,38.73 17.78,38.73 17.14,38.1 C20.1 | R25.2 24.77,40.32 22.86,40.32
STAGE_1  (via drill 1)
  Top 0.305: 16.83,33.34 R23.2 | C20.2 16.98,35.56
  Top 0.406: C20.2 19.05,35.71 IC10.1 | 16.83,35.56 16.98,35.56 R23.2 v15.24,33.34
STAGE_2
  Top 0.305: 20.32,43.5 21.91,43.5 22.54,44.13 22.54,44.77 23.18,45.4 23.18,45.41 IC9.7 | 20.32,43.5 IC10.7 | 20.32,43.5 17.14,43.5 C23.2
VBUS  (via drill 1)
  Top 0.305: 10.48,13.97 IC2.15 10.48,9.53 10.79,9.21 10.79,6.03 9.84,5.08 9.84,2.54 10.48,1.91 41.59,1.91 42.23,2.54 v45.09,2.54 46.04,2.54 46.67,3.17 46.67,4.76 47.31,5.4 51.75,5.4 57.15,10.79 57.15,13.58 CON4.+5V
WEST  (via drill 0.4)
  Top 0.305: v45.72,49.53 45.72,32.7 45.25,32.23 R18.2 | Q4.3 57.47,50.33 R16.2 53.49,50.33 v53.02,50.8
  Top 0.61: CON10.7 54.61,54.29 57.47,51.44 Q4.3
  Bottom 0.305: v45.72,49.53 46.99,50.8 v53.02,50.8
ZCD  (via drill 0.4)
  Top 0.305: 2.86,41.59 2.22,42.23 2.22,47.31 2.86,47.94 CON9.3 | 2.86,41.59 6.35,41.59 9.21,44.45 12.7,44.45 13.33,43.82 IC11.1 | v5.71,16.19 2.86,16.19 1.91,17.14 1.91,33.97 1.27,34.61 1.27,37.47 2.22,38.42 2.22,40.96 2.86,41.59 | IC2.16 11.75,15.56 11.11,16.19 v7.62,16.19
  Bottom 0.305: v7.62,16.19 v5.71,16.19

### Text on the board
tPlace: Ultrasonic Anemometer Rev B | Transducers | -N+ | -S+ | -E+ | -W+ | - | GND | ZCD | Inputs | Power | ADC- | ADC+ | + | 12V | GND | I2C Int | C | Rec | D | S1 | GND | soldernerd.com | SIG | Outputs | AXIS | DIR | PGC | -3V3 | PGD | +3V3 | Rails | ICSP | GND | 12V | 3V3 | GND | !MCLR! | + | GND | C | D | Ref | 3V3 | RDY | GND | MISO | MOSI | SCLK | !SS! | GND | - | USB | 5 | I2C External | SPI
bPlace: Lukas Fässler / August 2016 / Revision B / / soldernerd.com